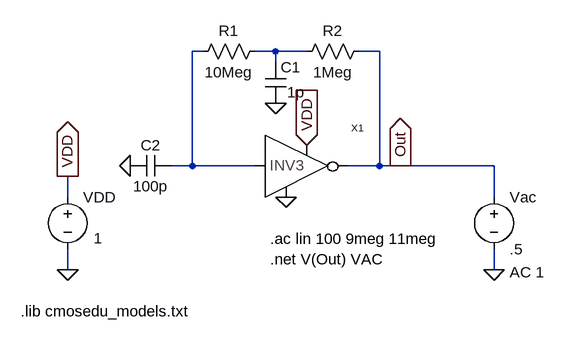
[diagram p0: schematic 09b_Inv3.asc]
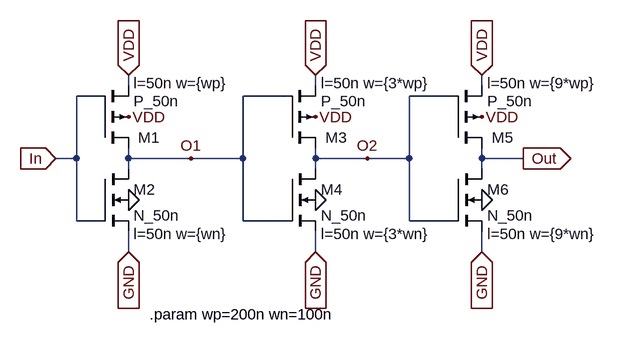
[diagram p1: sub-circuit inv3.asc]
09b_Inv3.asc, the LTspice schematic file:
Version 4
SHEET 1 880 680
WIRE -448 -80 -464 -80
WIRE -336 -80 -368 -80
WIRE -288 -80 -336 -80
WIRE -176 -80 -208 -80
WIRE -336 -64 -336 -80
WIRE -464 96 -464 -80
WIRE -464 96 -496 96
WIRE -368 96 -464 96
WIRE -176 96 -176 -80
WIRE -176 96 -224 96
WIRE -144 96 -176 96
WIRE 0 96 -144 96
WIRE -656 144 -656 112
WIRE 0 144 0 96
WIRE -656 256 -656 224
WIRE 0 256 0 224
FLAG -656 112 VDD
IOPIN -656 112 Out
FLAG -656 256 0
FLAG -320 144 0
FLAG 0 256 0
FLAG -288 64 VDD
IOPIN -288 64 In
FLAG -144 96 Out
IOPIN -144 96 Out
FLAG -336 0 0
FLAG -560 96 0
SYMBOL voltage 0 128 R0
WINDOW 123 24 132 Left 0
WINDOW 39 0 0 Left 0
SYMATTR Value2 AC 1
SYMATTR InstName Vac
SYMATTR Value .5
SYMBOL voltage -656 128 R0
WINDOW 3 40 79 Left 0
WINDOW 123 0 0 Left 0
WINDOW 39 0 0 Left 0
SYMATTR Value 1
SYMATTR InstName VDD
SYMBOL inv3 -352 144 R0
SYMATTR InstName X1
SYMBOL res -464 -64 R270
WINDOW 0 32 56 VTop 0
WINDOW 3 0 56 VBottom 0
SYMATTR InstName R1
SYMATTR Value 10Meg
SYMBOL res -304 -64 R270
WINDOW 0 32 56 VTop 0
WINDOW 3 0 56 VBottom 0
SYMATTR InstName R2
SYMATTR Value 1Meg
SYMBOL cap -352 -64 R0
WINDOW 3 34 47 Left 0
SYMATTR Value 1p
SYMATTR InstName C1
SYMBOL cap -560 112 R270
WINDOW 0 32 32 VTop 0
WINDOW 3 0 32 VBottom 0
SYMATTR InstName C2
SYMATTR Value 100p
TEXT -344 208 Left 0 !.ac lin 100 9meg 11meg
TEXT -728 320 Left 0 !.lib cmosedu_models.txt
TEXT -344 240 Left 0 !.net V(Out) VAC

inv3.asc, the sub-circuit schematic file:
Version 4
SHEET 1 880 680
WIRE -448 0 -448 -16
WIRE -160 0 -160 -16
WIRE 96 0 96 -16
WIRE -496 16 -528 16
WIRE -208 16 -272 16
WIRE 48 16 -16 16
WIRE -528 112 -528 16
WIRE -528 112 -560 112
WIRE -448 112 -448 96
WIRE -352 112 -448 112
WIRE -272 112 -272 16
WIRE -272 112 -352 112
WIRE -160 112 -160 96
WIRE -80 112 -160 112
WIRE -16 112 -16 16
WIRE -16 112 -80 112
WIRE 96 112 96 96
WIRE 160 112 96 112
WIRE -448 128 -448 112
WIRE -160 128 -160 112
WIRE 96 128 96 112
WIRE -528 208 -528 112
WIRE -496 208 -528 208
WIRE -272 208 -272 112
WIRE -208 208 -272 208
WIRE -16 208 -16 112
WIRE 48 208 -16 208
WIRE -448 256 -448 224
WIRE -160 256 -160 224
WIRE 96 256 96 224
FLAG -448 48 VDD
FLAG -448 176 0
FLAG -448 -16 VDD
IOPIN -448 -16 In
FLAG -160 48 VDD
FLAG -160 176 0
FLAG -160 -16 VDD
IOPIN -160 -16 In
FLAG 96 48 VDD
FLAG 96 176 0
FLAG 96 -16 VDD
IOPIN 96 -16 In
FLAG 160 112 Out
IOPIN 160 112 Out
FLAG -80 112 O2
FLAG -352 112 O1
FLAG -560 112 In
IOPIN -560 112 In
FLAG -448 256 GND
IOPIN -448 256 In
FLAG -160 256 GND
IOPIN -160 256 In
FLAG 96 256 GND
IOPIN 96 256 In
SYMBOL pmos4 -496 96 M180
WINDOW 0 63 16 Left 0
WINDOW 123 56 100 Left 0
SYMATTR InstName M1
SYMATTR Value2 l=50n w={wp}
SYMATTR Value P_50n
SYMBOL nmos4 -496 128 R0
WINDOW 123 56 100 Left 0
SYMATTR Value2 l=50n w={wn}
SYMATTR InstName M2
SYMATTR Value N_50n
SYMBOL pmos4 -208 96 M180
WINDOW 0 63 16 Left 0
WINDOW 123 56 100 Left 0
SYMATTR InstName M3
SYMATTR Value2 l=50n w={3*wp}
SYMATTR Value P_50n
SYMBOL nmos4 -208 128 R0
WINDOW 123 56 100 Left 0
SYMATTR Value2 l=50n w={3*wn}
SYMATTR InstName M4
SYMATTR Value N_50n
SYMBOL pmos4 48 96 M180
WINDOW 0 63 16 Left 0
WINDOW 123 56 100 Left 0
SYMATTR InstName M5
SYMATTR Value2 l=50n w={9*wp}
SYMATTR Value P_50n
SYMBOL nmos4 48 128 R0
WINDOW 123 56 100 Left 0
SYMATTR Value2 l=50n w={9*wn}
SYMATTR InstName M6
SYMATTR Value N_50n
TEXT -416 352 Left 0 !.param wp=200n wn=100n

The netlist it stands for:
* 09b_Inv3.asc
Vac Out 0 .5 AC 1
VDD VDD 0 1
XX1 N001 Out VDD 0 inv3
R1 N001 N002 10Meg
R2 N002 Out 1Meg
C1 N002 0 1p
C2 0 N001 100p

* block symbol definitions
.subckt inv3 In Out VDD GND
M1 O1 In VDD VDD P_50n l=50n w={wp}
M2 O1 In GND 0 N_50n l=50n w={wn}
M3 O2 O1 VDD VDD P_50n l=50n w={3*wp}
M4 O2 O1 GND 0 N_50n l=50n w={3*wn}
M5 Out O2 VDD VDD P_50n l=50n w={9*wp}
M6 Out O2 GND 0 N_50n l=50n w={9*wn}
.param wp=200n wn=100n
.ends inv3

.model NMOS NMOS
.model PMOS PMOS
.lib standard.mos
.ac lin 100 9meg 11meg
.lib cmosedu_models.txt
.net V(Out) VAC
.backanno
.end